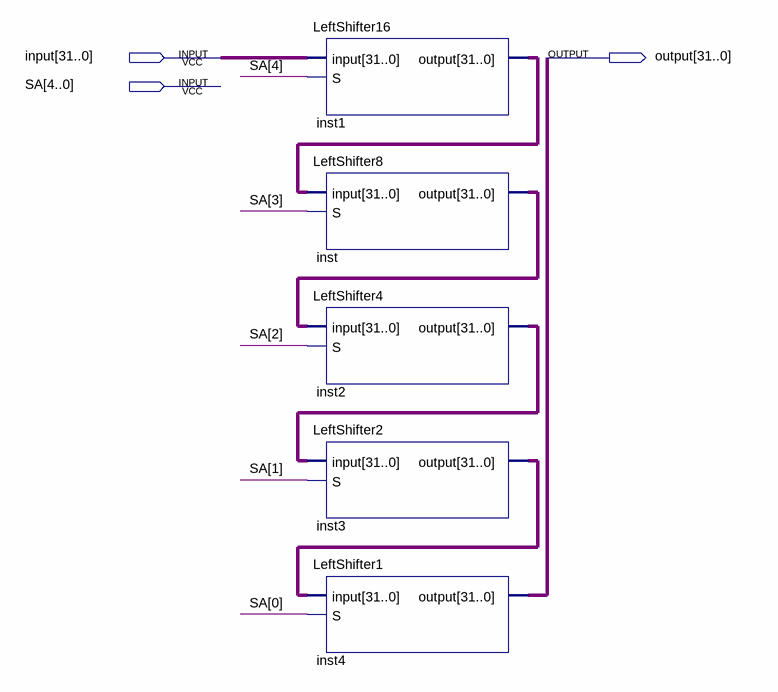
[diagram p0: schematic sheet]
// Quartus schematic LeftShifter.bdf as structural Verilog: 5 symbols, 3 pins
module LeftShifter (
  input  [31:0] \input ,
  input  [4:0] SA,
  output [31:0] \output 
);

  wire [31:0] inst1_output, inst2_output, inst3_output, inst_output;

  LeftShifter16 inst1 (.\input (\input ), .S(SA[4]), .\output (inst1_output));
  LeftShifter8 inst (.\input (inst1_output), .S(SA[3]), .\output (inst_output));
  LeftShifter4 inst2 (.\input (inst_output), .S(SA[2]), .\output (inst2_output));
  LeftShifter2 inst3 (.\input (inst2_output), .S(SA[1]), .\output (inst3_output));
  LeftShifter1 inst4 (.\input (inst3_output), .S(SA[0]), .\output (\output ));
endmodule
